# Altium schematic sheet Main.SchDoc
size A4; Author: Author; CompanyName: AGH Racing; Revision: Rev; SheetNumber: 0; SheetTotal: 0; CarNumber: 5; PageSetup: Record=PageOptions|CenterHorizontal=True|CenterVertical=True|PrintScale=1.00|XCorrection=1.00|YCorrection=1.00|PrintKind=0|BorderSize=5000000|LeftOffset=0|BottomOffset=0|Orientation=2|PaperLength=1000|PaperWidth=1000|Scale=100|PaperSource=15|PrintQuality=-3|MediaType=1|DitherType=10|PrintScaleMode=1|PaperKind=A4|PaperIndex=9; ProjectName: Project Name
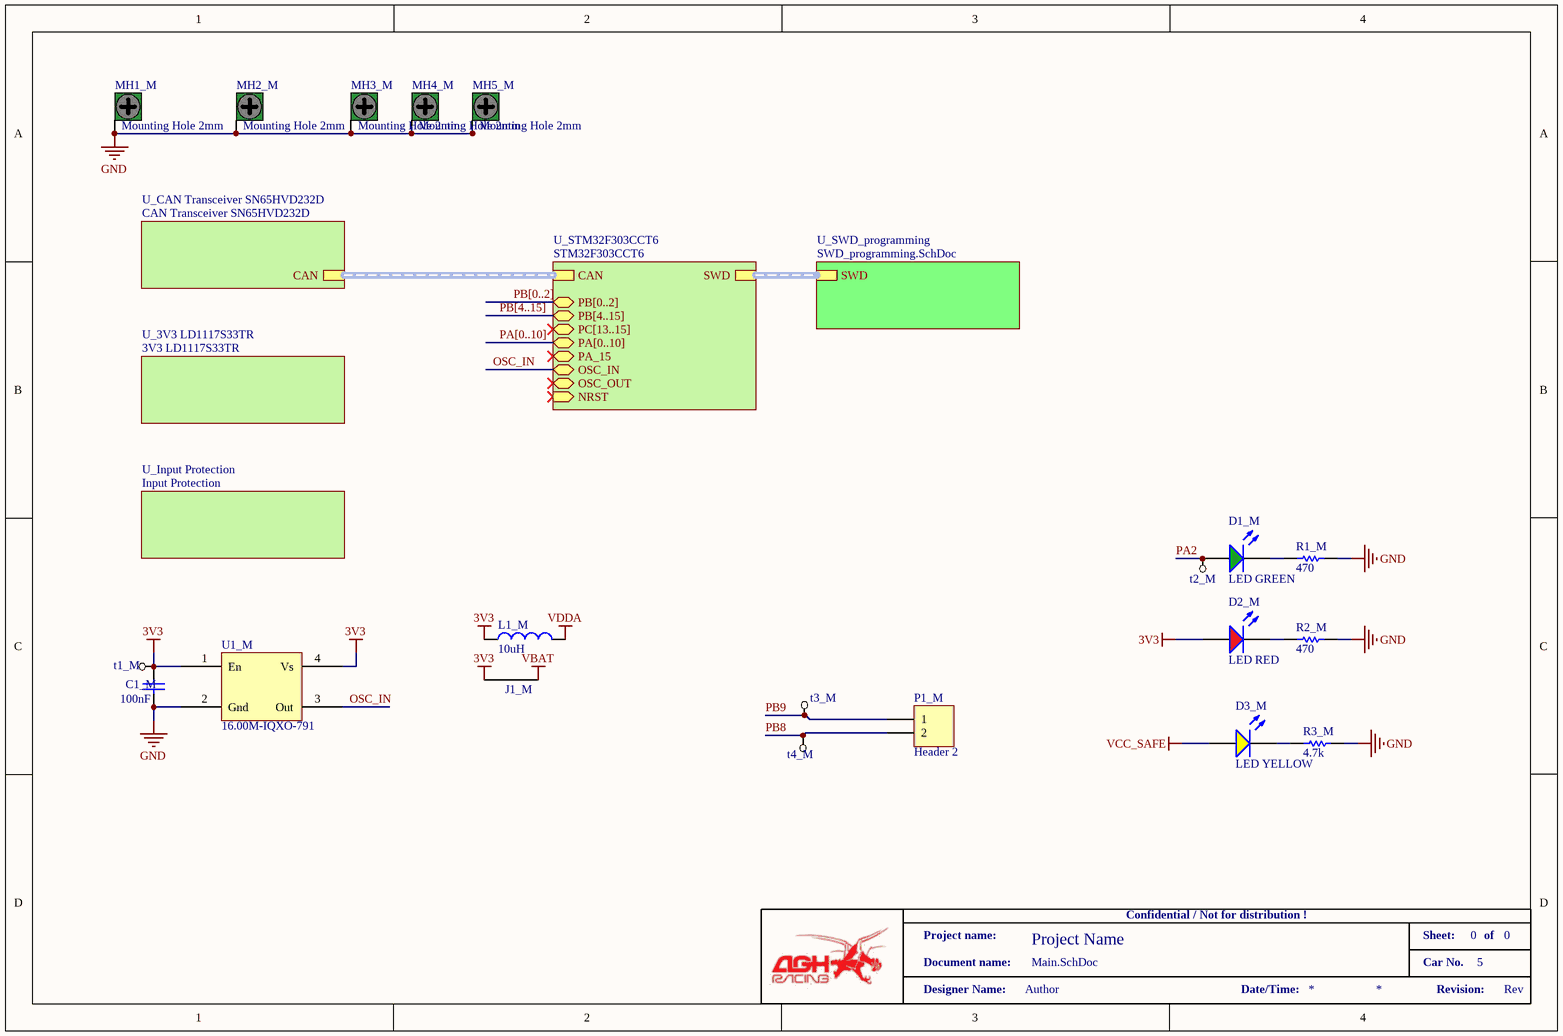
[diagram p0: Main.SchDoc]

## Parts
C1_M  value 100nF  [CAP_0603_IPC_MD]  (hidden comment: Cap)
D1_M  LED GREEN  [LED_0603_GREEN_IPC_MD]
D2_M  LED RED  [LED_0603_RED_IPC_MD]
D3_M  LED YELLOW  [LED_0603_YELLOW_IPC_MD]
J1_M  NetTie  [NETTIE]  (value not drawn)  (net tie, no BOM)
L1_M  value 10uH  [IND_0603_IPC_HD]  (hidden comment: Ind)
MH1_M  Mounting Hole 2mm  [MOUNTING HOLE 3mm]  (no BOM)
MH2_M  Mounting Hole 2mm  [MOUNTING HOLE 3mm]  (no BOM)
MH3_M  Mounting Hole 2mm  [MOUNTING HOLE 3mm]  (no BOM)
MH4_M  Mounting Hole 2mm  [MOUNTING HOLE 3mm]  (no BOM)
MH5_M  Mounting Hole 2mm  [MOUNTING HOLE 3mm]  (no BOM)
P1_M  Header 2  [MOLEX_2PIN]
R1_M  value 470  [RES_0603_IPC_MD]  (hidden comment: Res)
R2_M  value 470  [RES_0603_IPC_MD]  (hidden comment: Res)
R3_M  value 4.7k  [RES_0603_IPC_MD]  (hidden comment: Res)
t1_M  Test point  [Via_Test_Point]  (value not drawn)  (no BOM)
t2_M  Test point  [Via_Test_Point]  (value not drawn)  (no BOM)
t3_M  Test point  [Via_Test_Point]  (value not drawn)  (no BOM)
t4_M  Test point  [Via_Test_Point]  (value not drawn)  (no BOM)
U1_M  16.00M-IQXO-791  [ICLCX18]

## Sub-sheets
U_3V3 LD1117S33TR = 3V3 LD1117S33TR: no entries
U_CAN Transceiver SN65HVD232D = CAN Transceiver SN65HVD232D: CAN (harness CAN)
U_Input Protection = Input Protection: no entries
U_STM32F303CCT6 = STM32F303CCT6: CAN (harness CAN), SWD (harness SWD), PB[0..2] (bidir), PB[4..15] (bidir), PC[13..15] (bidir), PA[0..10] (bidir), PA_15 (bidir), OSC_IN (bidir), OSC_OUT (bidir), NRST (in)
U_SWD_programming = SWD_programming.SchDoc: SWD (harness SWD)

## Nets
3V3: C1_M.2 D2_M.1(A) J1_M.1 L1_M.1 U1_M.1(En) U1_M.4(Vs)
GND: C1_M.1 MH1_M.MOUNTING MH2_M.MOUNTING MH3_M.MOUNTING MH4_M.MOUNTING MH5_M.MOUNTING R1_M.1 R2_M.1 R3_M.1 U1_M.2(Gnd)
VBAT: J1_M.2
VCC_SAFE: D3_M.1(A)
VDDA: L1_M.2
OSC_IN: U1_M.3(Out) ; sheet U_STM32F303CCT6/OSC_IN
PA2: D1_M.1(A) t2_M.1
PB8: P1_M.2 t4_M.1
PB9: P1_M.1 t3_M.1
NetD1_M_2: D1_M.2(K) R1_M.2
NetD2_M_2: D2_M.2(K) R2_M.2
NetD3_M_2: D3_M.2(K) R3_M.2

Not connected (* = marked no-connect by the designer): t1_M 1

## Buses and harness runs
bus PA[0..10] = sheet U_STM32F303CCT6/PA[0..10]
bus PB[0..2] = sheet U_STM32F303CCT6/PB[0..2]
bus PB[4..15] = sheet U_STM32F303CCT6/PB[4..15]
harness sheet U_CAN Transceiver SN65HVD232D/CAN = sheet U_STM32F303CCT6/CAN
harness sheet U_STM32F303CCT6/SWD = sheet U_SWD_programming/SWD

## Notes on the sheet
- Confidential / Not for distribution !
- Project name:
- Document name:
- Sheet:
- Car No.
- of
- Designer Name:
- Date/Time:
- Revision:

## Library data of the parts
C1_M = Cap: Capacitor
L1_M = Ind: Inductor
MH1_M MH2_M MH3_M MH4_M MH5_M = Mounting Hole
P1_M = Header 2: Header, 2-Pin
R1_M R2_M R3_M = Res: Resistor
U1_M = 16.00M-IQXO-791: Crystal Clock Oscillator; Manufacturer: IQD FREQUENCY PRODUCTS; MPN: LFSPXO066657CUTT; Supplier: TME; SPN: 16.00M-IQXO-791; Name: 16.00M-IQXO-791